# EAGLE schematic Micromouse_controller_v001 (EAGLE 7.2.0)
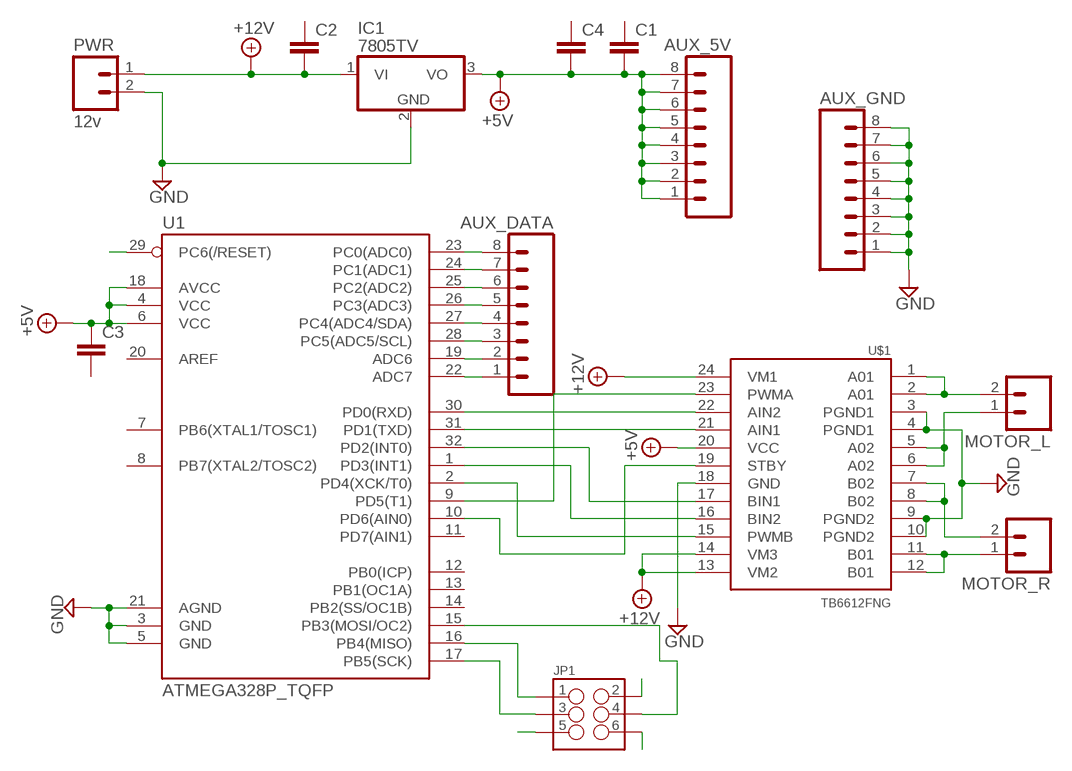
[diagram p0: schematic, sheet 1]

## Parts
AUX_5V  M08SMD-STRAIGHT-ALT-FEMALE  [1X08_SMD_ALT]
AUX_DATA  M08SMD-STRAIGHT-ALT-FEMALE  [1X08_SMD_ALT]
AUX_GND  M08SMD-STRAIGHT-ALT-FEMALE  [1X08_SMD_ALT]
C1  CAPSMD  [GRM43D]
C2  CAPSMD  [GRM43D]
C3  CAPSMD  [GRM43D]
C4  CAPSMD  [GRM43D]
IC1  7805TV  [TO220V]
JP1  M03X2FEMALE_SMD  [2X3_SMD]
MOTOR_L  M02-JST-2MM-SMT  [JST-2-SMD]
MOTOR_R  M02-JST-2MM-SMT  [JST-2-SMD]
PWR  12v  M02-JST-2MM-SMT  [JST-2-SMD]
U1  ATMEGA328P_TQFP  [TQFP32-08]
U$1  TB6612FNG  [SSOP24]

## Nets
+5V: AUX_5V.1 AUX_5V.2 AUX_5V.3 AUX_5V.4 AUX_5V.5 AUX_5V.6 AUX_5V.7 AUX_5V.8 C1.C C3.A C4.C IC1.3(VO) JP1.2 U1.4(VCC) U1.6(VCC) U1.18(AVCC) U$1.20(VCC)
+12V: C2.C IC1.1(VI) PWR.1 U$1.13(VM2) U$1.14(VM3) U$1.24(VM1)
GND: AUX_GND.1 AUX_GND.2 AUX_GND.3 AUX_GND.4 AUX_GND.5 AUX_GND.6 AUX_GND.7 AUX_GND.8 IC1.2(GND) JP1.6 PWR.2 U1.3(GND) U1.5(GND) U1.21(AGND) U$1.3(PGND1) U$1.4(PGND1) U$1.9(PGND2) U$1.10(PGND2) U$1.18(GND)
N$1: AUX_DATA.8 U1.23(PC0(ADC0))
N$2: AUX_DATA.7 U1.24(PC1(ADC1))
N$3: AUX_DATA.6 U1.25(PC2(ADC2))
N$4: AUX_DATA.5 U1.26(PC3(ADC3))
N$5: AUX_DATA.4 U1.27(PC4(ADC4/SDA))
N$6: AUX_DATA.3 U1.28(PC5(ADC5/SCL))
N$7: U1.2(PD4(XCK/T0)) U$1.15(PWMB)
N$8: U1.9(PD5(T1)) U$1.23(PWMA)
N$9: U1.30(PD0(RXD)) U$1.22(AIN2)
N$10: U1.31(PD1(TXD)) U$1.21(AIN1)
N$11: MOTOR_L.2 U$1.1(A01) U$1.2(A01)
N$12: MOTOR_L.1 U$1.5(A02) U$1.6(A02)
N$13: MOTOR_R.1 U$1.11(B01) U$1.12(B01)
N$14: MOTOR_R.2 U$1.7(B02) U$1.8(B02)
N$15: U1.32(PD2(INT0)) U$1.17(BIN1)
N$16: U1.1(PD3(INT1)) U$1.16(BIN2)
N$17: JP1.1 U1.16(PB4(MISO))
N$18: JP1.3 U1.17(PB5(SCK))
N$19: U1.10(PD6(AIN0)) U$1.19(STBY)
N$20: AUX_DATA.2 U1.19(ADC6)
N$21: AUX_DATA.1 U1.22(ADC7)
N$22: JP1.4 U1.15(PB3(MOSI/OC2))
RST: JP1.5 U1.29(PC6(/RESET))
Unconnected: C1.A C2.A C3.C C4.A U1.7(PB6(XTAL1/TOSC1)) U1.8(PB7(XTAL2/TOSC2)) U1.11(PD7(AIN1)) U1.12(PB0(ICP)) U1.13(PB1(OC1A)) U1.14(PB2(SS/OC1B)) U1.20(AREF)

## Library data of the parts
AUX_5V AUX_DATA AUX_GND = SparkFun-Connectors:M08: Header 8 Standard 8-pin 0.1" header. Use with straight break away headers (SKU : PRT-00116), right angle break away headers (PRT-00553), swiss pins (PRT-00743), machine pins (PRT-00117), and female headers (PRT-00115).; PROD_ID: CONN-10204
C1-C4 = SparkFun-Capacitors:CAP: Capacitor Standard 0603 ceramic capacitor, and 0.1" leaded capacitor.
IC1 = linear:78*: Positive VOLTAGE REGULATOR Source: http://cache.national.com/ds/LM/LM78L05.pdf http://www.fairchildsemi.com/ds/LM/LM7805.pdf
JP1 = SparkFun-Connectors:M03X2: 2x3 .1" header. Shrouded, with keying- CONN-10681 SMT- CONN-11415 Pogo pins- HW-11044; PROD_ID: CONN-11290
MOTOR_L MOTOR_R PWR = SparkFun-Connectors:M02: Standard 2-pin 0.1" header. Use with - straight break away headers ( PRT-00116) - right angle break away headers (PRT-00553) - swiss pins (PRT-00743) - machine pins (PRT-00117) - female headers (PRT-00115) Molex polarized connector foot print use with: PRT-08233 with associated crimp pins and housings. 2.54_SCREWTERM for use with PRT-10571. 3.5mm Screw Terminal footprints for PRT-08084 5mm Screw Terminal footprints for use with PRT-08432; PROD_ID: CONN-11443
U1 = SparkFun-DigitalIC:ATMEGA328P_TQFP; PROD_ID: IC-09069
U$1 = SparkFun-PowerIC:TB6612FNG: Toshiba 1A dual motor driver IC-09363; PROD_ID: IC-09363